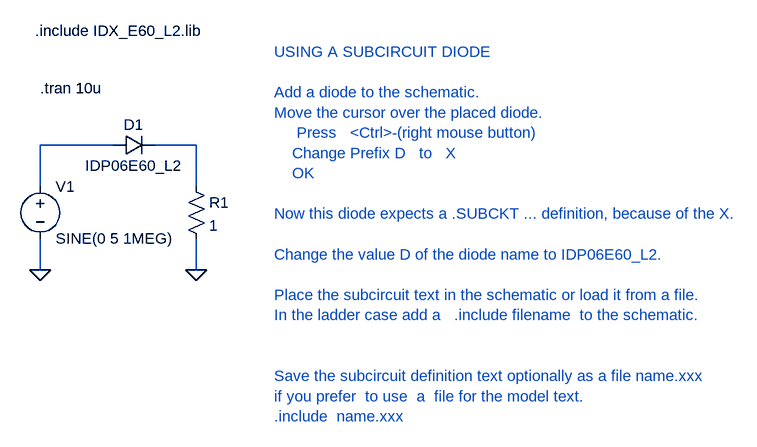
[diagram p0: schematic idp06e60_test.asc]
idp06e60_test.asc, the LTspice schematic file:
Version 4
SHEET 1 1488 1320
WIRE 32 128 -80 128
WIRE -80 128 -80 192
WIRE -80 272 -80 320
WIRE 96 128 160 128
WIRE 160 128 160 192
WIRE 160 272 160 320
FLAG -80 320 0
FLAG 160 320 0
SYMBOL diode 32 144 R270
WINDOW 0 32 32 VTop 0
WINDOW 3 0 32 VBottom 0
SYMATTR InstName D1
SYMATTR Value IDP06E60_L2
SYMATTR Prefix X
SYMBOL voltage -80 176 R0
WINDOW 123 0 0 Left 0
WINDOW 39 0 0 Left 0
SYMATTR InstName V1
SYMATTR Value SINE(0 5 1MEG)
SYMBOL res 144 176 R0
SYMATTR InstName R1
SYMATTR Value 1
TEXT -80 40 Left 0 !.tran 10u
TEXT 280 -16 Left 0 ;USING A SUBCIRCUIT DIODE\n \nAdd a diode to the schematic.\nMove the cursor over the placed diode.\n     Press   <Ctrl>-(right mouse button)   \n    Change Prefix D   to   X\n    OK\n \nNow this diode expects a .SUBCKT ... definition, because of the X.\n \nChange the value D of the diode name to IDP06E60_L2.\n \nPlace the subcircuit text in the schematic or load it from a file.\nIn the ladder case add a   .include filename  to the schematic.\n \n \nSave the subcircuit definition text optionally as a file name.xxx\nif you prefer  to use  a  file for the model text. \n.include  name.xxx
TEXT -88 -48 Left 0 !.include IDX_E60_L2.lib

The netlist it stands for:
* idp06e60_test.asc
XD1 N001 N002 IDP06E60_L2  ; pins + -
V1 N001 0 SINE(0 5 1MEG)
R1 N002 0 1
.tran 10u
* USING A SUBCIRCUIT DIODE
* Add a diode to the schematic.
* Move the cursor over the placed diode.
*      Press   <Ctrl>-(right mouse button)
*     Change Prefix D   to   X
*     OK
* Now this diode expects a .SUBCKT ... definition, because of the X.
* Change the value D of the diode name to IDP06E60_L2.
* Place the subcircuit text in the schematic or load it from a file.
* In the ladder case add a   .include filename  to the schematic.
* Save the subcircuit definition text optionally as a file name.xxx
* if you prefer  to use  a  file for the model text.
* .include  name.xxx
.include IDX_E60_L2.lib
.backanno
.end